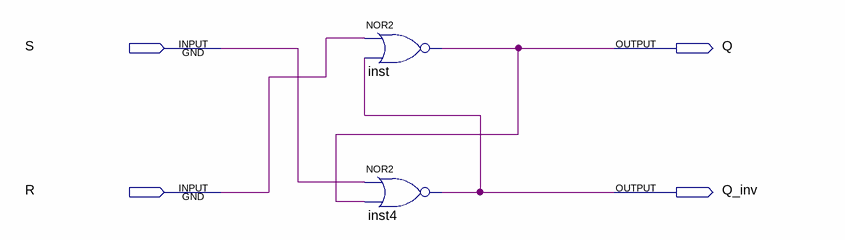
[diagram p0: schematic sheet]
// Quartus schematic RS_trig.bdf as structural Verilog: 2 symbols, 4 pins
module RS_trig (
  input  S,
  input  R,
  output Q,
  output Q_inv
);

  nor inst (Q, R, Q_inv);
  nor inst4 (Q_inv, S, Q);
endmodule
